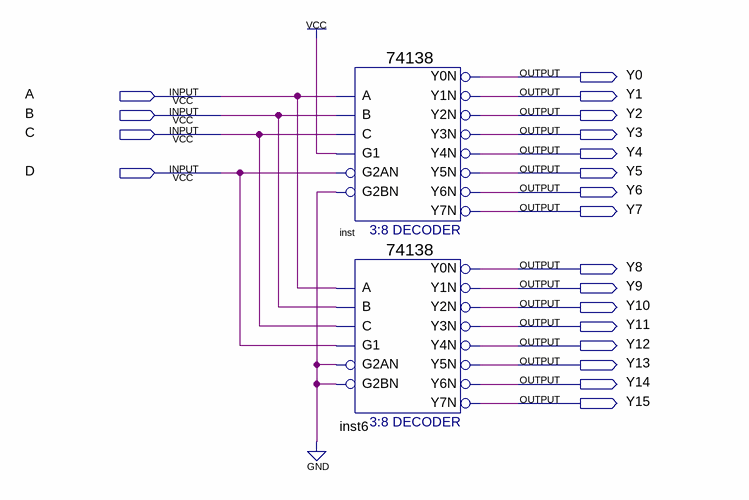
[diagram p0: schematic sheet]
// Quartus schematic four_line_to_sixteen_line_decimal_decoder.bdf as structural Verilog: 2 symbols, 20 pins
module four_line_to_sixteen_line_decimal_decoder (
  input  A,
  input  B,
  input  C,
  input  D,
  output Y0,
  output Y1,
  output Y2,
  output Y3,
  output Y4,
  output Y5,
  output Y6,
  output Y7,
  output Y8,
  output Y9,
  output Y10,
  output Y11,
  output Y12,
  output Y13,
  output Y14,
  output Y15
);

  \74138  inst (
    .A(A), .B(B), .G1(1'b1), .C(C), .G2AN(D), .G2BN(1'b0), .Y0N(Y0), .Y1N(Y1), .Y2N(Y2), .Y3N(Y3), .Y4N(Y4),
    .Y5N(Y5), .Y6N(Y6), .Y7N(Y7));
  \74138  inst6 (
    .A(A), .B(B), .G1(D), .C(C), .G2AN(1'b0), .G2BN(1'b0), .Y0N(Y8), .Y1N(Y9), .Y2N(Y10), .Y3N(Y11),
    .Y4N(Y12), .Y5N(Y13), .Y6N(Y14), .Y7N(Y15));
endmodule
